# EAGLE schematic Payloadv05 (EAGLE 9.2.0)
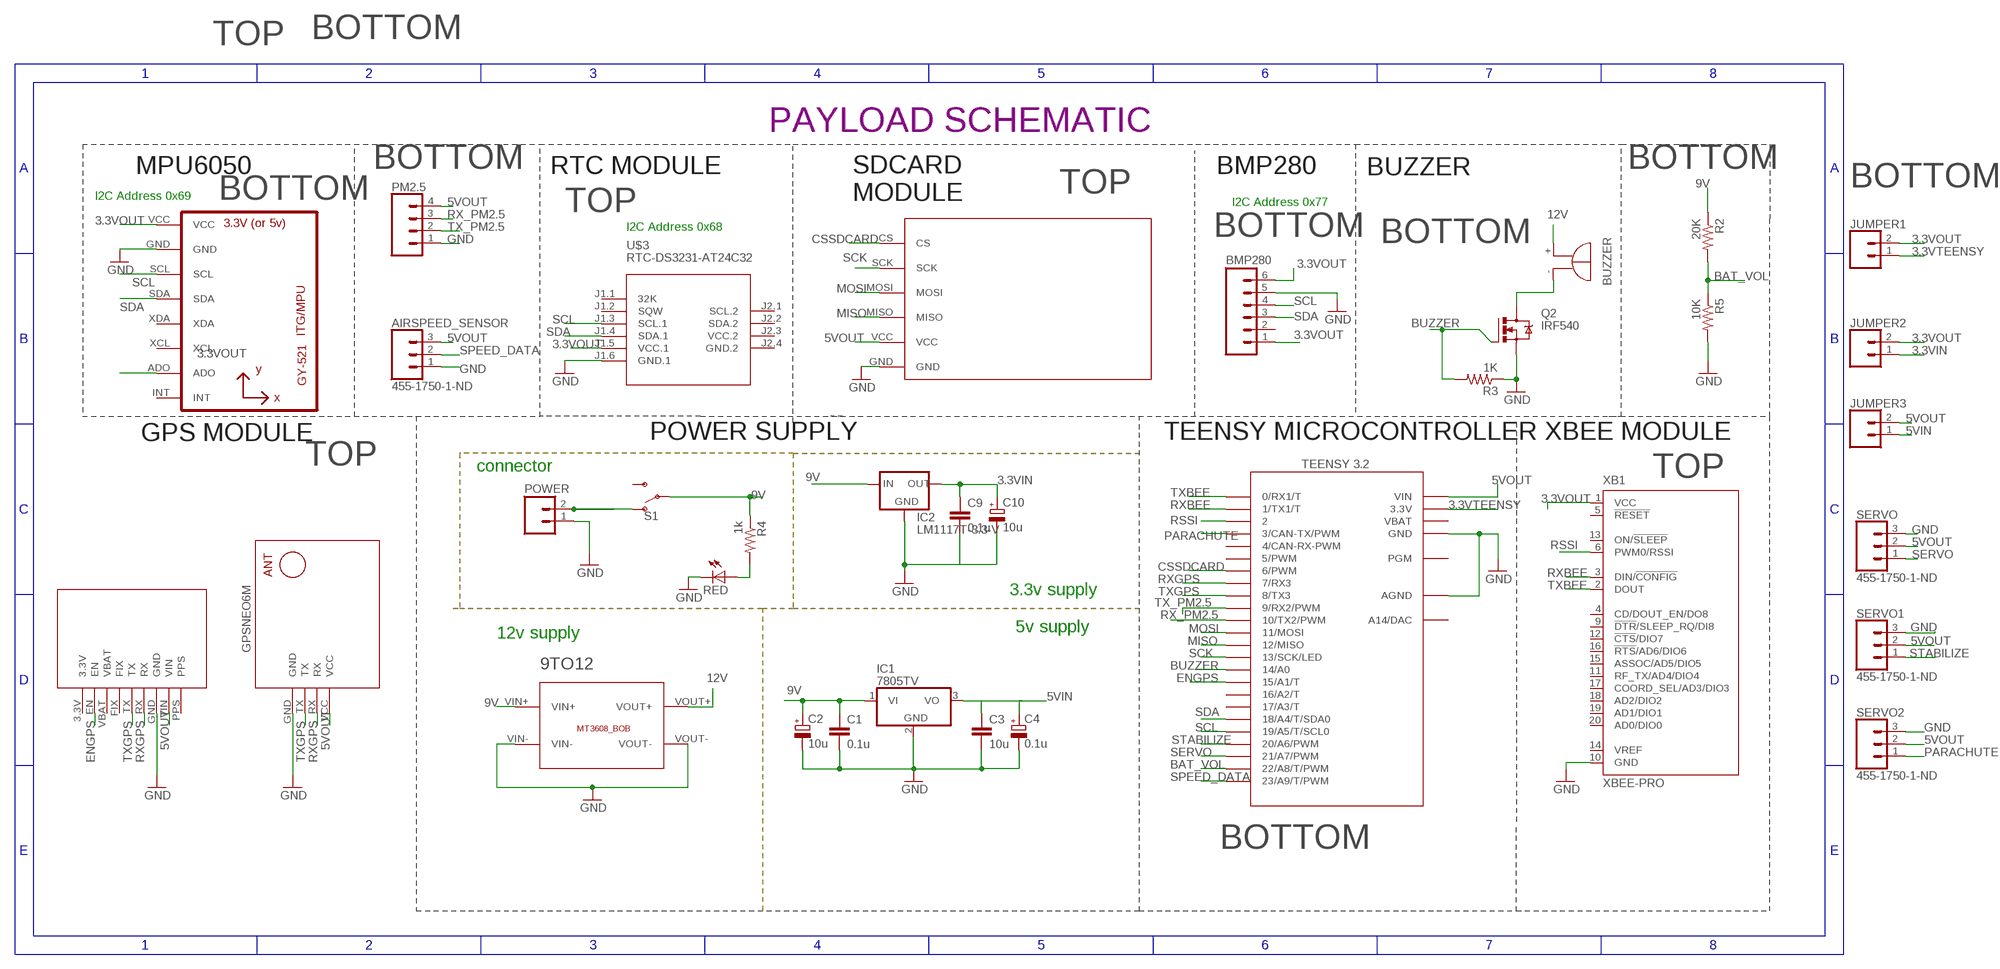
[diagram p0: schematic, sheet 1]

## Parts
9TO12  BREAKOUTS_MT3608_BOB  [BREAKOUTS_MT3608_BOB]
AIRSPEED_SENSOR  455-1750-1-ND  CONN_03  [1X03]
BMP280  M06  [06P]
C1  0.1u  C-EU025-025X050  [C025-025X050]
C2  10u  CPOL-EUE2.5-6  [E2,5-6]
C3  10u  C-EU025-025X050  [C025-025X050]
C4  0.1u  CPOL-EUE2.5-6  [E2,5-6]
C9  0.1u  C-EU025-025X050  [C025-025X050]
C10  10u  CPOL-EUE2.5-6  [E2,5-6]
IC1  7805TV  [TO220V]
IC2  LM1117T-3.3-V  [TO220V]
JUMPER1  CONN_02  [1X02]
JUMPER2  CONN_02  [1X02]
JUMPER3  CONN_02  [1X02]
PM2.5  CONN_04  [1X04]
POWER  CEDT_JANUARY_2015_V5_M02  [CEDT_JANUARY_2015_V5_02P]
Q2  IRF540  [TO220BV]
R2  20K  R-US_0204/7  [0204/7]
R3  1K  R-US_0204/7  [0204/7]
R4  1k  R-US_0204/7  [0204/7]
R5  10K  R-US_0204/7  [0204/7]
RED  red  LED3MM  [LED3MM]
S1  SWITCH-SPDT-PTH-11.6X4.0MM  [SWITCH_SPDT_PTH_11.6X4.0MM]
SERVO  455-1750-1-ND  CONN_03  [1X03]
SERVO1  455-1750-1-ND  CONN_03  [1X03]
SERVO2  455-1750-1-ND  CONN_03  [1X03]
SG1  BUZZER_EB2209A  [BUZZER_EB2209A]
U1  GY-521MPU6050  [GY-521]
U$1  GPS-RECEIVER-NEO6M  [GPS-RECEIVER-NEO6M]
U$2  TEENSY_3.1-3.2_OUTER_ROW  [TEENSY_3.0-3.2&LC_OUTER_ROW]
U$3  RTC-DS3231-AT24C32  [RTC-DS3231-AT24C32]
U$4  ADAFRUIT_GPS  [ADAFRUIT_GPS]
U$5  SDCARD  [M0SDCARDMODULE]
XB1  XBEE-PRO  [XBEE-PRO]

## Nets
3.3VIN: C9.1 C10.+ IC2.2(OUT) JUMPER2.1
3.3VOUT: BMP280.1 BMP280.6 JUMPER1.2 JUMPER2.2 U1.ADO U1.VCC U$3.J1.5(VCC.1) XB1.1(VCC)
3.3VTEENSY: JUMPER1.1 U$2.3.3V U$2.3.3V1(3.3V)
5VIN [power]: C3.1 C4.+ IC1.3(VO) JUMPER3.1
5VOUT: AIRSPEED_SENSOR.3 JUMPER3.2 PM2.5.4 SERVO1.2 SERVO2.2 SERVO.2 U$1.VCC U$2.VIN U$4.VIN U$5.VCC
9V [power]: 9TO12.VIN+ C1.1 C2.+ IC1.1(VI) IC2.3(IN) R2.1 R4.1 S1.2(P)
12V [power]: 9TO12.VOUT+ SG1.+
BAT_VOL: R2.2 R5.1 U$2.22/A8(22/A8/T/PWM)
BUZZER: Q2.G R3.2 U$2.14/A0
CSSDCARD: U$2.6(6/PWM) U$5.CS
ENGPS: U$2.15/A1(15/A1/T) U$4.EN
GND [power]: 9TO12.VIN- 9TO12.VOUT- AIRSPEED_SENSOR.1 BMP280.5 C1.2 C2.- C3.2 C4.- C9.2 C10.- IC1.2(GND) IC2.1(GND) PM2.5.1 POWER.1 Q2.S R3.1 R5.2 RED.K(C) SERVO1.3 SERVO2.3 SERVO.3 U1.GND U$1.GND U$2.AGND U$2.GND U$2.GND1(GND) U$3.J1.6(GND.1) U$4.GND U$5.GND XB1.10(GND)
MISO: U$2.12(12/MISO) U$5.MISO
MOSI: U$2.11(11/MOSI) U$5.MOSI
N$1 [power]: POWER.2 S1.1(O)
N$2: R4.2 RED.A
N$3 [power]: Q2.D SG1.-
PARACHUTE: SERVO2.1 U$2.3(3/CAN-TX/PWM)
RSSI: U$2.2 XB1.6(PWM0/RSSI)
RX_PM2.5: PM2.5.3 U$2.10(10/TX2/PWM)
RXBEE: U$2.1(1/TX1/T) XB1.3(DIN/!CONFIG)
RXGPS: U$1.RX U$2.7(7/RX3) U$4.RX
SCK: U$2.13(13/SCK/LED) U$5.SCK
SCL: BMP280.4 U1.SCL U$2.19/A5(19/A5/T/SCL0) U$3.J1.3(SCL.1)
SDA: BMP280.3 U1.SDA U$2.18/A4(18/A4/T/SDA0) U$3.J1.4(SDA.1)
SERVO: SERVO.1 U$2.21/A7(21/A7/PWM)
SPEED_DATA: AIRSPEED_SENSOR.2 U$2.23/A9(23/A9/T/PWM)
STABILIZE: SERVO1.1 U$2.20/A6(20/A6/PWM)
TX_PM2.5: PM2.5.2 U$2.9(9/RX2/PWM)
TXBEE: U$2.0(0/RX1/T) XB1.2(DOUT)
TXGPS: U$1.TX U$2.8(8/TX3) U$4.TX
Unconnected: BMP280.2 S1.3(S) U1.INT U1.XCL U1.XDA U$2.4(4/CAN-RX-PWM) U$2.5(5/PWM) U$2.16/A2(16/A2/T) U$2.17/A3(17/A3/T) U$2.PGM U$2.RESET/DAC(A14/DAC) U$3.J1.1(32K) U$3.J1.2(SQW) U$3.J2.1(SCL.2) U$3.J2.2(SDA.2) U$4.3.3V U$4.FIX U$4.PPS U$4.VBAT XB1.4(CD/DOUT_EN/DO8) XB1.5(!RESET) XB1.9(!DTR!/SLEEP_RQ/DI8) XB1.11(RF_TX/AD4/DIO4) XB1.12(!CTS!/DIO7) XB1.13(ON/!SLEEP) XB1.14(VREF) XB1.15(ASSOC/AD5/DIO5) XB1.16(!RTS!/AD6/DIO6) XB1.17(COORD_SEL/AD3/DIO3) XB1.18(AD2/DIO2) XB1.19(AD1/DIO1) XB1.20(AD0/DIO0)

## Notes on the sheet
- TOP | BOTTOM
- PAYLOAD SCHEMATIC
- MPU6050 | BOTTOM | RTC MODULE | BMP280 | BUZZER | BOTTOM
- TOP | BOTTOM
- I2C Address 0x69 | BOTTOM
- SDCARD
  MODULE
- I2C Address 0x77
- TOP
- I2C Address 0x68
- BOTTOM | BOTTOM
- GPS MODULE | POWER SUPPLY | TEENSY MICROCONTROLLER | XBEE MODULE
- TOP
- connector
- TOP
- 3.3v supply
- 5v supply
- 12v supply
- BOTTOM

## Power pins joined to a net without a drawn wire
GND.2: U$3.J2.4(GND.2)
VBAT: U$2.VBAT
VCC.2: U$3.J2.3(VCC.2)

## Library data of the parts
9TO12 = Cansat2019_3279_Container_v01:BREAKOUTS_MT3608_BOB
AIRSPEED_SENSOR SERVO SERVO1 SERVO2 = SparkFun-Connectors:CONN_03: Multi connection point. Often used as Generic Header-pin footprint for 0.1 inch spaced/style header connections On any of the 0.1 inch spaced packages, you can populate with these: Break Away Headers - Straight <https://www.sparkfun.com/products/116> (PRT-00116) Break Away Male Headers - Right Angle <https://www.sparkfun.com/products/553> (PRT-00553) Female Headers <https://www.sparkfun.com/products/115> (PRT-00115) Break Away Headers - Machine Pin <https://www.sparkfun.com/products/117> (PRT-00117) Break Away Female Headers - Swiss Machine Pin <https://www.sparkfun.com/products/743> (PRT-00743) Stackable Header - 3 Pin (Female, 0.1") <https://www.sparkfun.com/products/13875> (PRT-13875) For SCREWTERMINALS and SPRING TERMINALS visit here: Screw Terimnals on SparkFun.com <https://www.sparkfun.com/search/results?term=Screw+Terminals> (5mm/3.5mm/2.54mm spacing) This device is also useful as a general connection point to wire up your design to another part of your project. Our various solder wires solder well into these plated through hole pads. Hook-Up Wire - Assortment (Stranded, 22 AWG) <https://www.sparkfun.com/products/11375> (PRT-11375) Hook-Up Wire - Assortment (Solid Core, 22 AWG) <https://www.sparkfun.com/products/11367> (PRT-11367) View the entire wire category on our website here <https://www.sparkfun.com/categories/141> Special notes: Molex polarized connector foot print use with SKU : PRT-08232 with associated crimp pins and housings.; PROD_ID: XXX-00000
BMP280 = con-amp-quick:M06: AMP QUICK CONNECTOR; OC_FARNELL: unknown; OC_NEWARK: unknown
C1 C3 C9 = resistor:C-EU: CAPACITOR, European symbol
C2 C4 C10 = rcl:CPOL-EU: POLARIZED CAPACITOR, European symbol; SPICEPREFIX: C
IC1 = linear:78*: Positive VOLTAGE REGULATOR Source: http://cache.national.com/ds/LM/LM78L05.pdf http://www.fairchildsemi.com/ds/LM/LM7805.pdf
IC2 = lm1117:LM1117T-*
JUMPER1-JUMPER3 = SparkFun-Connectors:CONN_02: Multi connection point. Often used as Generic Header-pin footprint for 0.1 inch spaced/style header connections On any of the 0.1 inch spaced packages, you can populate with these: Break Away Headers - Straight <https://www.sparkfun.com/products/116> (PRT-00116) Break Away Male Headers - Right Angle <https://www.sparkfun.com/products/553> (PRT-00553) Female Headers <https://www.sparkfun.com/products/115> (PRT-00115) Break Away Headers - Machine Pin <https://www.sparkfun.com/products/117> (PRT-00117) Break Away Female Headers - Swiss Machine Pin <https://www.sparkfun.com/products/743> (PRT-00743) For SCREWTERMINALS and SPRING TERMINALS visit here: Screw Terimnals on SparkFun.com <https://www.sparkfun.com/search/results?term=Screw+Terminals> (5mm/3.5mm/2.54mm spacing) This device is also useful as a general connection point to wire up your design to another part of your project. Our various solder wires solder well into these plated through hole pads. Hook-Up Wire - Assortment (Stranded, 22 AWG) <https://www.sparkfun.com/products/11375> (PRT-11375) Hook-Up Wire - Assortment (Solid Core, 22 AWG) <https://www.sparkfun.com/products/11367> (PRT-11367) View the entire wire category on our website here <https://www.sparkfun.com/categories/141> Special notes: Molex polarized connector foot print use with: PRT-08233 with associated crimp pins and housings. 2.54_SCREWTERM for use with PRT-10571. 3.5mm Screw Terminal footprints for PRT-08084 5mm Screw Terminal footprints for use with PRT-08432
PM2.5 = SparkFun-Connectors:CONN_04: Multi connection point. Often used as Generic Header-pin footprint for 0.1 inch spaced/style header connections On any of the 0.1 inch spaced packages, you can populate with these: Break Away Headers - Straight <https://www.sparkfun.com/products/116> (PRT-00116) Break Away Male Headers - Right Angle <https://www.sparkfun.com/products/553> (PRT-00553) Female Headers <https://www.sparkfun.com/products/115> (PRT-00115) Break Away Headers - Machine Pin <https://www.sparkfun.com/products/117> (PRT-00117) Break Away Female Headers - Swiss Machine Pin <https://www.sparkfun.com/products/743> (PRT-00743) For SCREWTERMINALS and SPRING TERMINALS visit here: Screw Terimnals on SparkFun.com <https://www.sparkfun.com/search/results?term=Screw+Terminals> (5mm/3.5mm/2.54mm spacing) This device is also useful as a general connection point to wire up your design to another part of your project. Our various solder wires solder well into these plated through hole pads. Hook-Up Wire - Assortment (Stranded, 22 AWG) <https://www.sparkfun.com/products/11375> (PRT-11375) Hook-Up Wire - Assortment (Solid Core, 22 AWG) <https://www.sparkfun.com/products/11367> (PRT-11367) View the entire wire category on our website here <https://www.sparkfun.com/categories/141> Special notes: Molex polarized connector foot print use with SKU : PRT-08231 with associated crimp pins and housings. 1MM SMD Version SKU: PRT-10208; PROD_ID: CONN-09696
POWER = Cansat2019_3279_Container_v01:CEDT_JANUARY_2015_V5_M02: AMP QUICK CONNECTOR
Q2 = transistor-power:IRF540: HEXFET Power MOSFET
R2-R5 = rcl:R-US_: RESISTOR, American symbol; SPICEPREFIX: R
RED = CEDT_JANUARY_2015_v5:LED
S1 = SparkFun-Switches:SWITCH-SPDT: Single Pole, Double Throw (SPDT) Switch Single-pole, double-throw (SPDT) switch. Variant Overview SMD-AYZ0202 Surface Mount DPDT Switch <https://www.sparkfun.com/products/597> (COM-00597) Used on e.g. LilyPad Arduino USB - ATmega32U4 Board <https://www.sparkfun.com/products/12049> PTH-11.6X4.0MM SPDT Mini Power Switch <https://www.sparkfun.com/products/102> (COM-00102) Used on e.g. SparkFun Simon Says - Through-Hole Soldering Kit <https://www.sparkfun.com/products/10547> (KIT-10547) PTH-11.6X4.0MM-KIT KIT version of SPDT Mini Power Switch - Simplifies soldering by removing tStop of switch pins - only one side can be soldered. PTH-11.6X4.0MM-LOCK LOCK version of SPDT Mini Power Switch - Offset pins hold switch in place for easier soldering. SMD-RIGHT-ANGLE Surface Mount Right Angle Switch <https://www.sparkfun.com/products/10860> (COM-10860) Used on e.g. SparkFun ESP8266 Thing <https://www.sparkfun.com/products/13231>; PROD_ID: SWCH-08261; SF_SKU: COM-00102
SG1 = Cansat2019_3279_Container_v01:BUZZER_EB2209A: BUZZER Source: Buerklin; OC_FARNELL: unknown; OC_NEWARK: unknown
U1 = gy-521:GY-521
U$1 = diy-modules:GPS-RECEIVER-NEO6M: GPS Receiver Module based on NEO-6 device Short tutorial how to use NEO-6 module with Arduino: http://www.xarg.org/2016/06/neo6mv2-gps-module-with-arduino/ NEO-6 datasheet is available here: https://www.u-blox.com/sites/default/files/products/documents/NEO-6_DataSheet_%28GPS.G6-HW-09005%29.pdf Click here to find device on ebay.com <http://www.ebay.com/sch/gyneo6mv2>
U$2 = Teensy_3_and_LC_Series_Boards_v1.4:TEENSY_3.1-3.2_OUTER_ROW: Footprint for Teensy 3.1 or 3.2 board using all pin connections on the outer perimeter
U$3 = diy-modules:RTC-DS3231-AT24C32: RTC Module with Battery and EEPROM based on DS3231 and AT24C32 chips Tutorial can be found here: https://edwardmallon.wordpress.com/2014/05/21/using-a-cheap-3-ds3231-rtc-at24c32-eeprom-from-ebay/ Click here to find device on ebay.com <http://www.ebay.com/sch/DS3231+AT24C32+module>
U$4 = myLib_adafruit_gps:ADAFRUIT_GPS
U$5 = mylib:SDCARD
XB1 = maxstream:XBEE: XBee (TM) /XBee-PRO(TM) OEM RF Modules Source: MaxStream, Inc. xbee_productmanual.pdf; MPN: XBP24-AWI-001; OC_FARNELL: 1337916; OC_NEWARK: 42M2667

## Net classes
0 default: width 0.508 mm
1 power: width 0.61 mm